# EAGLE design hygiea_v0.0 (EAGLE 8.6.0)

## Sheet 1 of 5: Description: Esquemático principal.
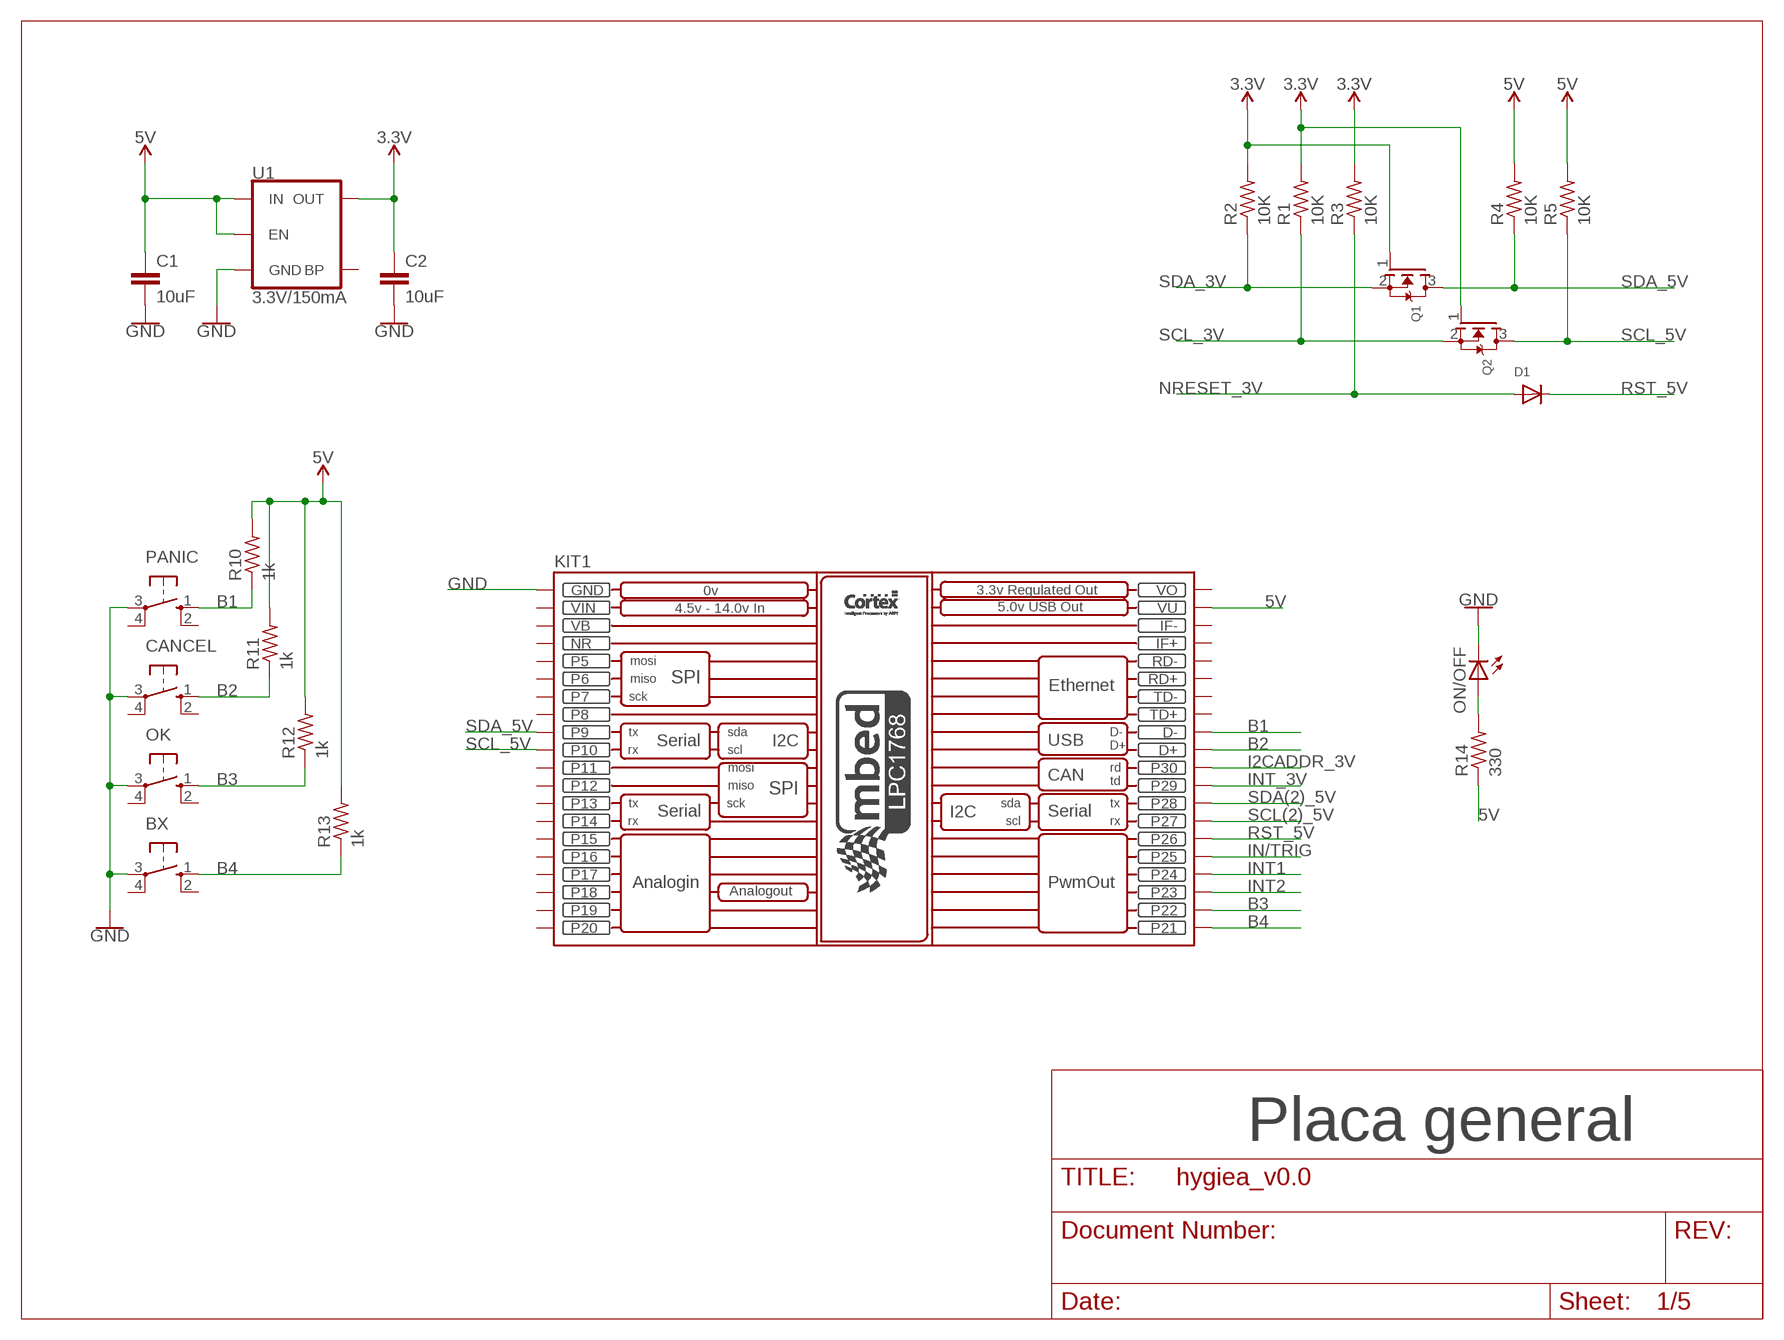
[diagram p0: schematic, sheet 1]

### Parts
BX  10-XX  [B3F-10XX]
C1  10uF  C-EUC0805  [C0805]
C2  10uF  C-EUC0805  [C0805]
CANCEL  10-XX  [B3F-10XX]
D1  DIODESOD-323F  [SOD-323F]
KIT1  MBED_NXP_LPC1768  [MBED-KIT]
OK  10-XX  [B3F-10XX]
ON/OFF  LEDCHIP-LED0805  [CHIP-LED0805]
PANIC  10-XX  [B3F-10XX]
Q1  MOSFET-NWAVE  [SOT23-W]
Q2  MOSFET-NWAVE  [SOT23-W]
R1  10K  R-US_R0805  [R0805]
R2  10K  R-US_R0805  [R0805]
R3  10K  R-US_R0805  [R0805]
R4  10K  R-US_R0805  [R0805]
R5  10K  R-US_R0805  [R0805]
R10  1k  R-US_R0805  [R0805]
R11  1k  R-US_R0805  [R0805]
R12  1k  R-US_R0805  [R0805]
R13  1k  R-US_R0805  [R0805]
R14  330  R-US_R0805  [R0805]
U1  3.3V/150mA  V_REG_MIC52053.3V  [SOT23-5]

### Nets
3.3V: C2.1 Q1.1(G) Q2.1(G) R1.2 R2.2 R3.2 U1.5(OUT) ; also sheet 2,5
5V: C1.1 KIT1.VU R4.2 R5.2 R10.2 R11.2 R12.2 R13.2 R14.1 U1.1(IN) U1.3(EN) ; also sheet 3,4
B1: KIT1.D- PANIC.1(S) R10.1
B2: CANCEL.1(S) KIT1.D+ R11.1
B3: KIT1.P$22(P22) OK.1(S) R12.1
B4: BX.1(S) KIT1.P$21(P21) R13.1
GND: BX.3(P) C1.2 C2.2 CANCEL.3(P) KIT1.GND OK.3(P) ON/OFF.C PANIC.3(P) U1.2(GND) ; also sheet 2,3,4,5
I2CADDR_3V: KIT1.P$30(P30) ; also sheet 2
IN/TRIG: KIT1.P$25(P25) ; also sheet 3
INT1: KIT1.P$24(P24) ; also sheet 5
INT2: KIT1.P$23(P23) ; also sheet 5
INT_3V: KIT1.P$29(P29) ; also sheet 2
N$1: ON/OFF.A R14.2
NRESET_3V: D1.A R3.1 ; also sheet 2
RST_5V: D1.C KIT1.P$26(P26)
SCL(2)_5V: KIT1.P$27(P27) ; also sheet 4
SCL_3V: Q2.2(S) R1.1 ; also sheet 2,5
SCL_5V: KIT1.P$10(P10) Q2.3(D) R5.1 ; also sheet 3
SDA(2)_5V: KIT1.P$28(P28) ; also sheet 4
SDA_3V: Q1.2(S) R2.1 ; also sheet 2,5
SDA_5V: KIT1.P$9(P9) Q1.3(D) R4.1 ; also sheet 3
Unconnected: BX.2(S1) BX.4(P1) CANCEL.2(S1) CANCEL.4(P1) KIT1.IF+ KIT1.IF- KIT1.P$5(P5) KIT1.P$6(P6) KIT1.P$7(P7) KIT1.P$8(P8) KIT1.P$11(P11) KIT1.P$12(P12) KIT1.P$13(P13) KIT1.P$14(P14) KIT1.P$15(P15) KIT1.P$16(P16) KIT1.P$17(P17) KIT1.P$18(P18) KIT1.P$19(P19) KIT1.P$20(P20) KIT1.RD+ KIT1.RD- KIT1.TD+ KIT1.TD- OK.2(S1) OK.4(P1) PANIC.2(S1) PANIC.4(P1) U1.4(BP)

### Notes on the sheet
- Placa general

## Sheet 2 of 5: BNO055
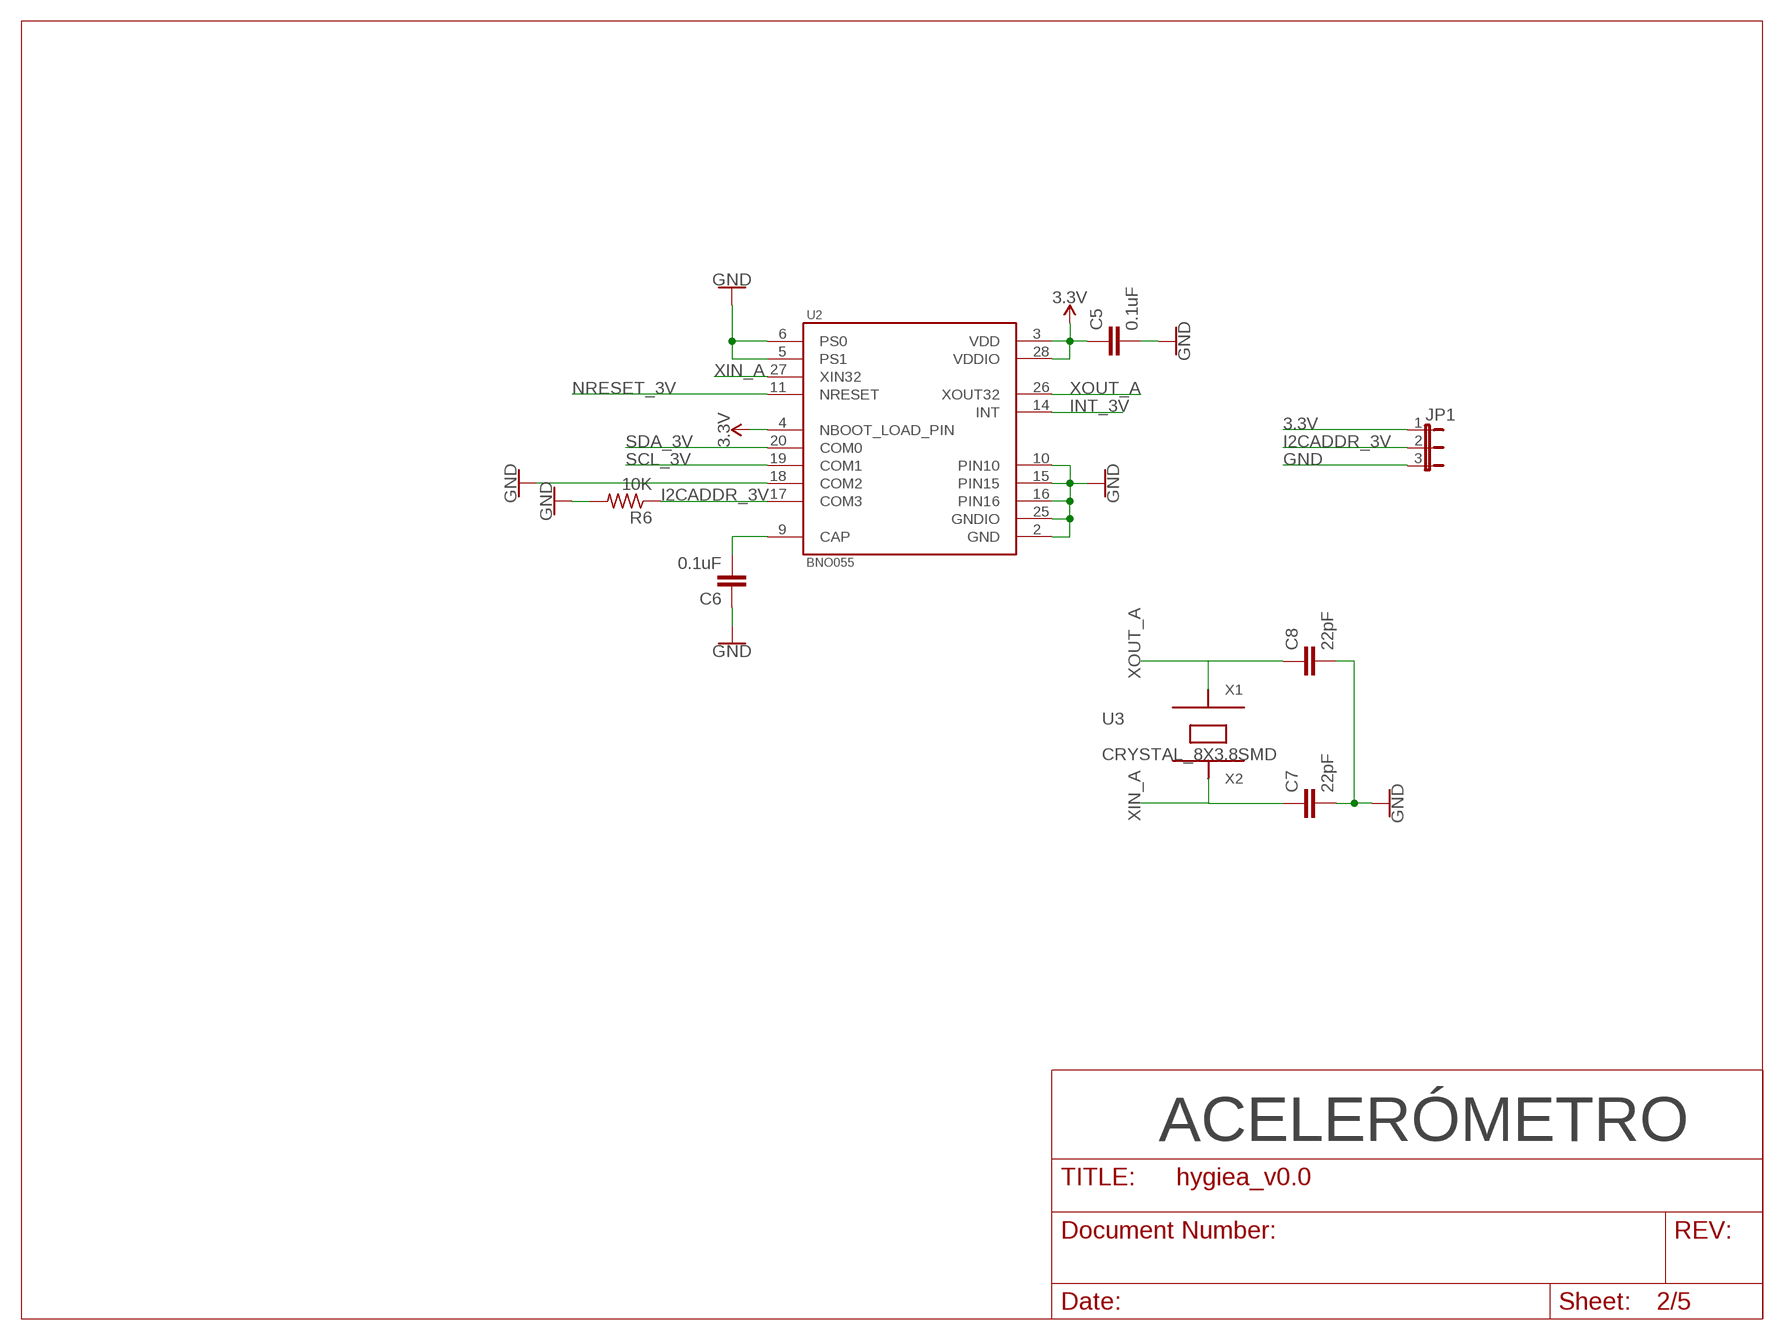
[diagram p1: schematic, sheet 2]

### Parts
C5  0.1uF  C-EUC0805  [C0805]
C6  0.1uF  C-EUC0805  [C0805]
C7  22pF  C-EUC0805  [C0805]
C8  22pF  C-EUC0805  [C0805]
JP1  JP2E  [JP2]
R6  10K  R-US_R0805  [R0805]
U2  BNO055  [LGA28R50P4X10_380X520X100]
U3  CRYSTAL_8X3.8SMD  [PM8.0X3.8MM]

### Nets
3.3V: C5.1 JP1.1 U2.3(VDD) U2.4(NBOOT_LOAD_PIN) U2.28(VDDIO) ; also sheet 1,5
GND: C5.2 C6.1 C7.2 C8.2 JP1.3 R6.2 U2.2(GND) U2.5(PS1) U2.6(PS0) U2.10(PIN10) U2.15(PIN15) U2.16(PIN16) U2.18(COM2) U2.25(GNDIO) ; also sheet 1,3,4,5
I2CADDR_3V: JP1.2 R6.1 U2.17(COM3) ; also sheet 1
INT_3V: U2.14(INT) ; also sheet 1
N$3: C6.2 U2.9(CAP)
NRESET_3V: U2.11(NRESET) ; also sheet 1
SCL_3V: U2.19(COM1) ; also sheet 1,5
SDA_3V: U2.20(COM0) ; also sheet 1,5
XIN_A: C7.1 U2.27(XIN32) U3.4(X2)
XOUT_A: C8.1 U2.26(XOUT32) U3.1(X1)

### Notes on the sheet
- ACELERÓMETRO

## Sheet 3 of 5: DRV2605L
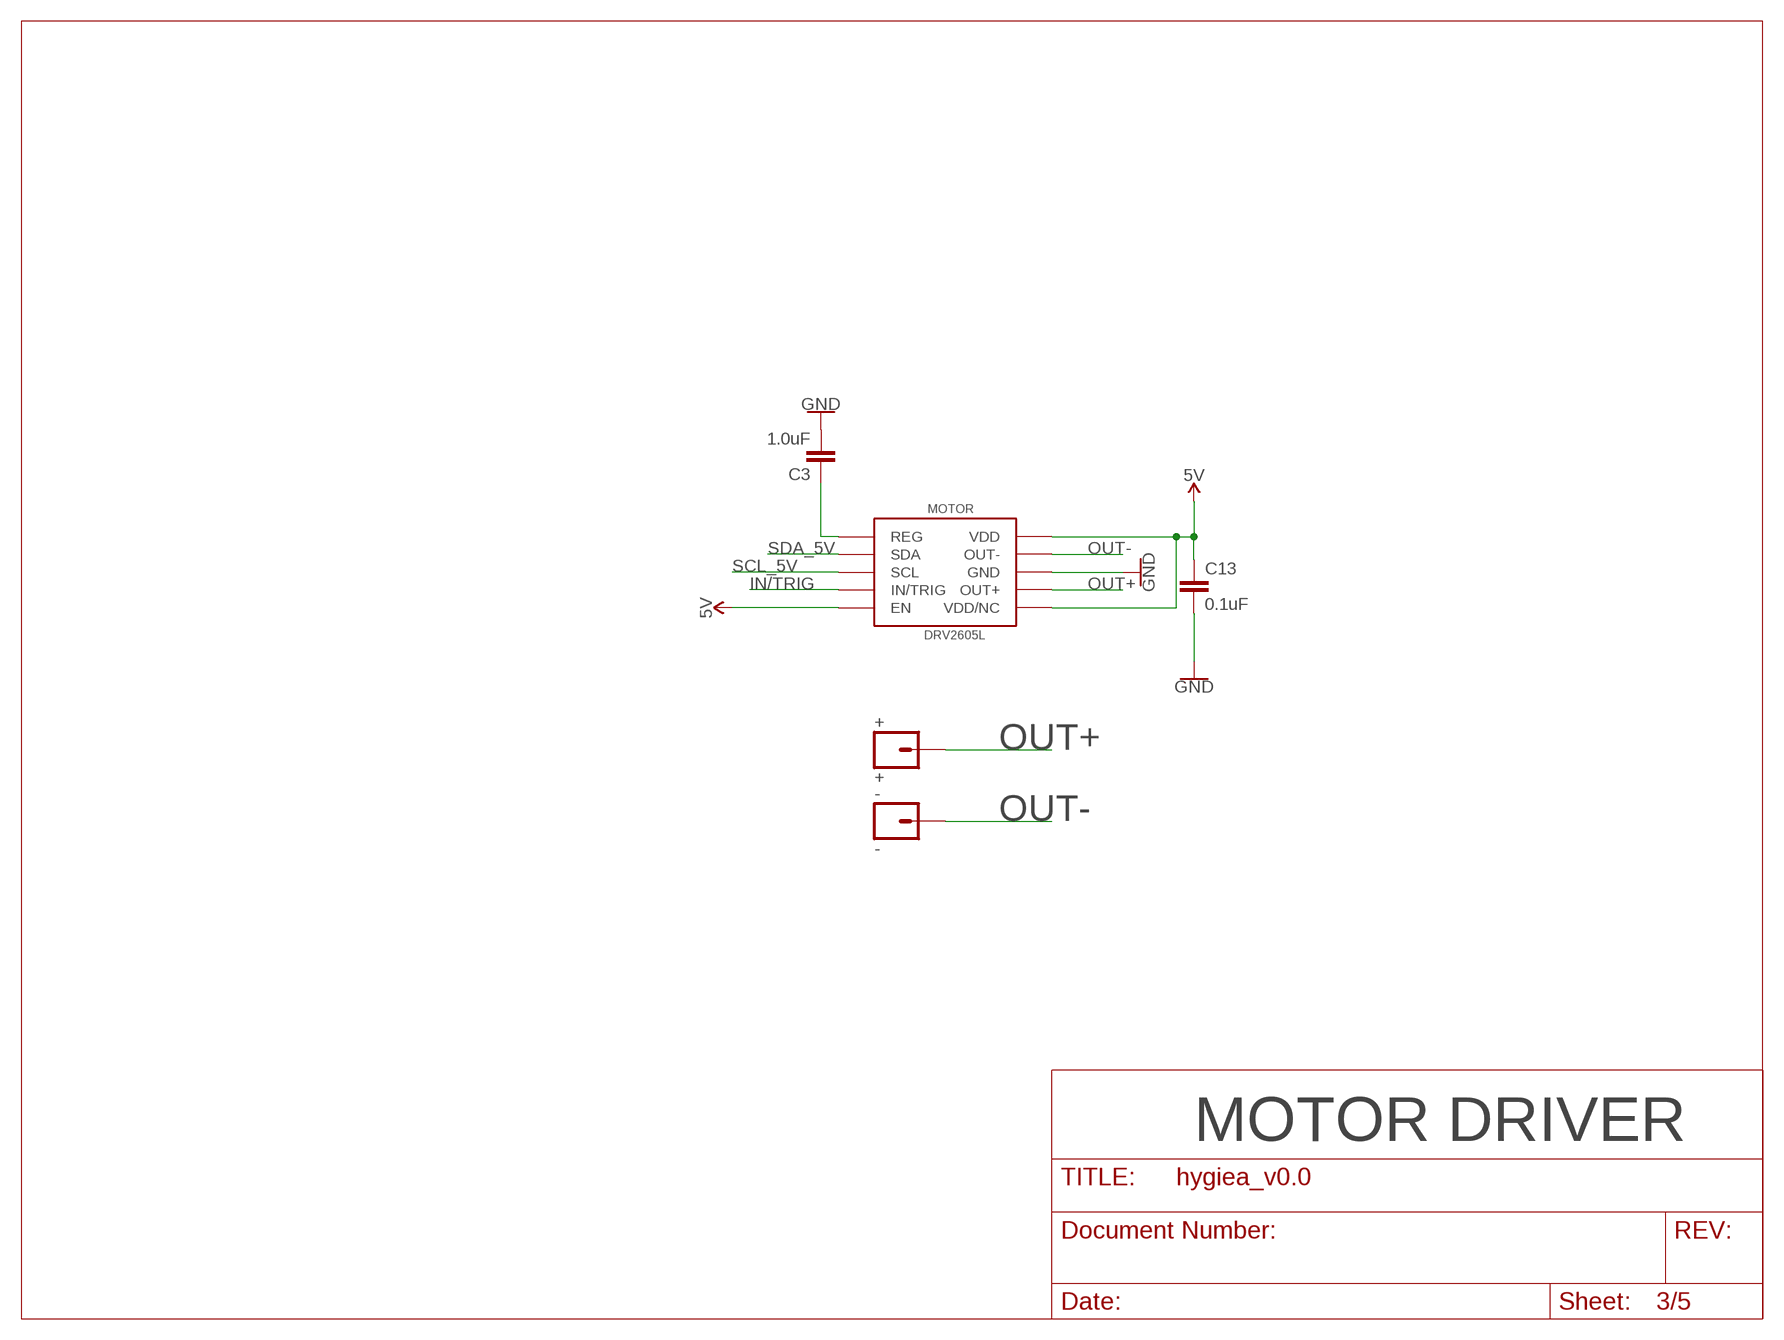
[diagram p2: schematic, sheet 3]

### Parts
+  +  CONN_01OFFSET  [1X01_OFFSET]
-  -  CONN_01OFFSET  [1X01_OFFSET]
C3  1.0uF  C-EUC0805  [C0805]
C13  0.1uF  C-EUC0805  [C0805]
MOTOR  DRV2605L  [VSSOP-10]

### Nets
5V: C13.1 MOTOR.P$5(EN) MOTOR.P$6(VDD/NC) MOTOR.P$10(VDD) ; also sheet 1,4
GND: C3.2 C13.2 MOTOR.P$8(GND) ; also sheet 1,2,4,5
IN/TRIG: MOTOR.P$4(IN/TRIG) ; also sheet 1
N$6: C3.1 MOTOR.P$1(REG)
OUT+: +.1 MOTOR.P$7(OUT+)
OUT-: -.1 MOTOR.P$9(OUT-)
SCL_5V: MOTOR.P$2(SCL) ; also sheet 1
SDA_5V: MOTOR.P$3(SDA) ; also sheet 1

### Notes on the sheet
- MOTOR DRIVER

## Sheet 4 of 5: BLE module
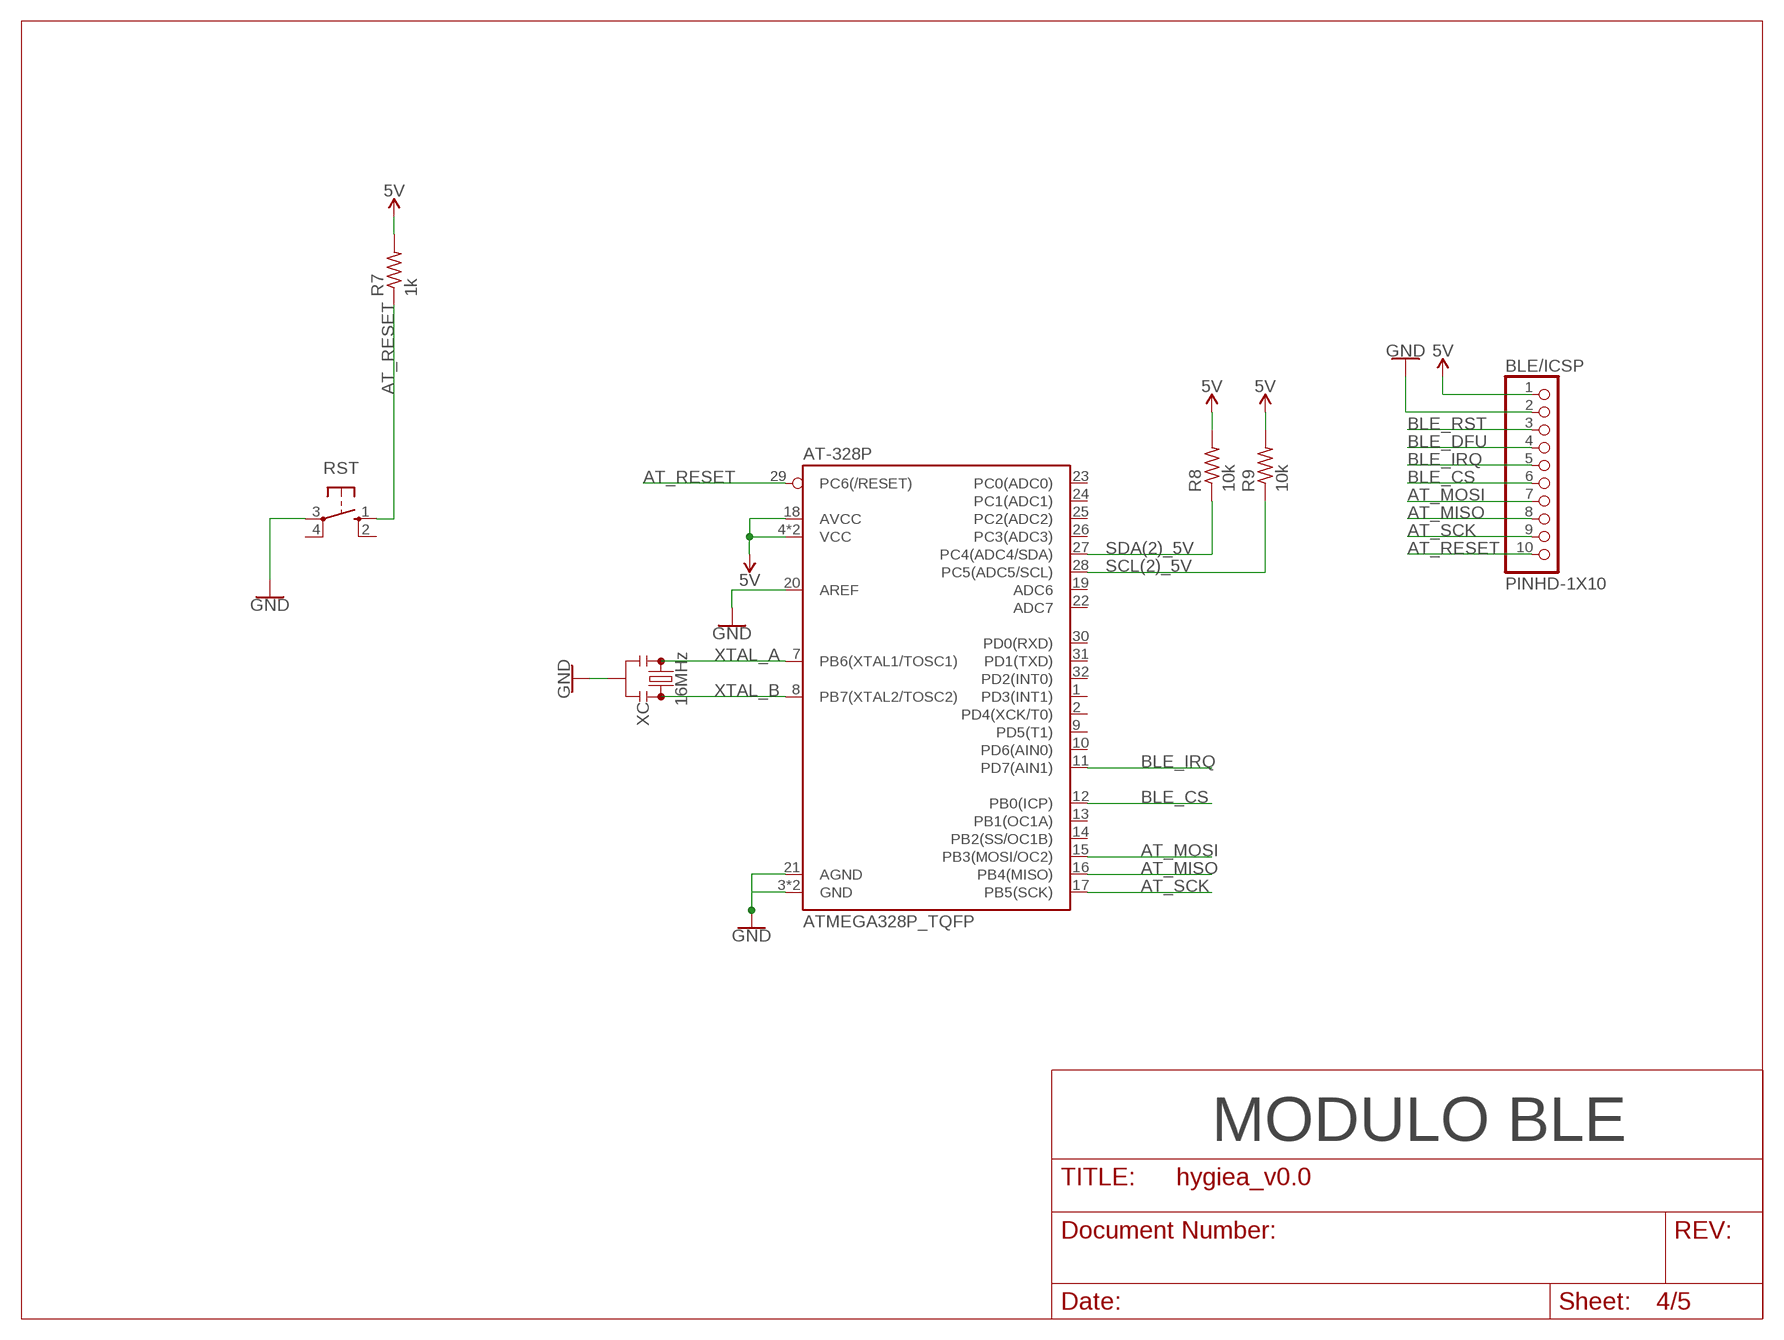
[diagram p3: schematic, sheet 4]

### Parts
AT-328P  ATMEGA328P_TQFP  [TQFP32-08]
BLE/ICSP  PINHD-1X10  [1X10-BIG]
R7  1k  R-US_R0805  [R0805]
R8  10k  R-US_R0805  [R0805]
R9  10k  R-US_R0805  [R0805]
RST  10-XX  [B3F-10XX]
XC  16MHz  RESONATOR-16MHZSMD_3.2X1.3  [RESONATOR-SMD-3.2X1.3]

### Nets
5V: AT-328P.4(VCC) AT-328P.6(VCC) AT-328P.18(AVCC) BLE/ICSP.1 R7.2 R8.2 R9.2 ; also sheet 1,3
AT_MISO: AT-328P.16(PB4(MISO)) BLE/ICSP.8
AT_MOSI: AT-328P.15(PB3(MOSI/OC2)) BLE/ICSP.7
AT_RESET: AT-328P.29(PC6(/RESET)) BLE/ICSP.10 R7.1 RST.1(S)
AT_SCK: AT-328P.17(PB5(SCK)) BLE/ICSP.9
BLE_CS: AT-328P.12(PB0(ICP)) BLE/ICSP.6
BLE_DFU: BLE/ICSP.4
BLE_IRQ: AT-328P.11(PD7(AIN1)) BLE/ICSP.5
BLE_RST: BLE/ICSP.3
GND: AT-328P.3(GND) AT-328P.5(GND) AT-328P.20(AREF) AT-328P.21(AGND) BLE/ICSP.2 RST.3(P) XC.2 ; also sheet 1,2,3,5
SCL(2)_5V: AT-328P.28(PC5(ADC5/SCL)) R9.1 ; also sheet 1
SDA(2)_5V: AT-328P.27(PC4(ADC4/SDA)) R8.1 ; also sheet 1
XTAL_A: AT-328P.7(PB6(XTAL1/TOSC1)) XC.3
XTAL_B: AT-328P.8(PB7(XTAL2/TOSC2)) XC.1
Unconnected: AT-328P.1(PD3(INT1)) AT-328P.2(PD4(XCK/T0)) AT-328P.9(PD5(T1)) AT-328P.10(PD6(AIN0)) AT-328P.13(PB1(OC1A)) AT-328P.14(PB2(SS/OC1B)) AT-328P.19(ADC6) AT-328P.22(ADC7) AT-328P.23(PC0(ADC0)) AT-328P.24(PC1(ADC1)) AT-328P.25(PC2(ADC2)) AT-328P.26(PC3(ADC3)) AT-328P.30(PD0(RXD)) AT-328P.31(PD1(TXD)) AT-328P.32(PD2(INT0)) RST.2(S1) RST.4(P1)

### Notes on the sheet
- MODULO BLE

## Sheet 5 of 5: MPL3115A2
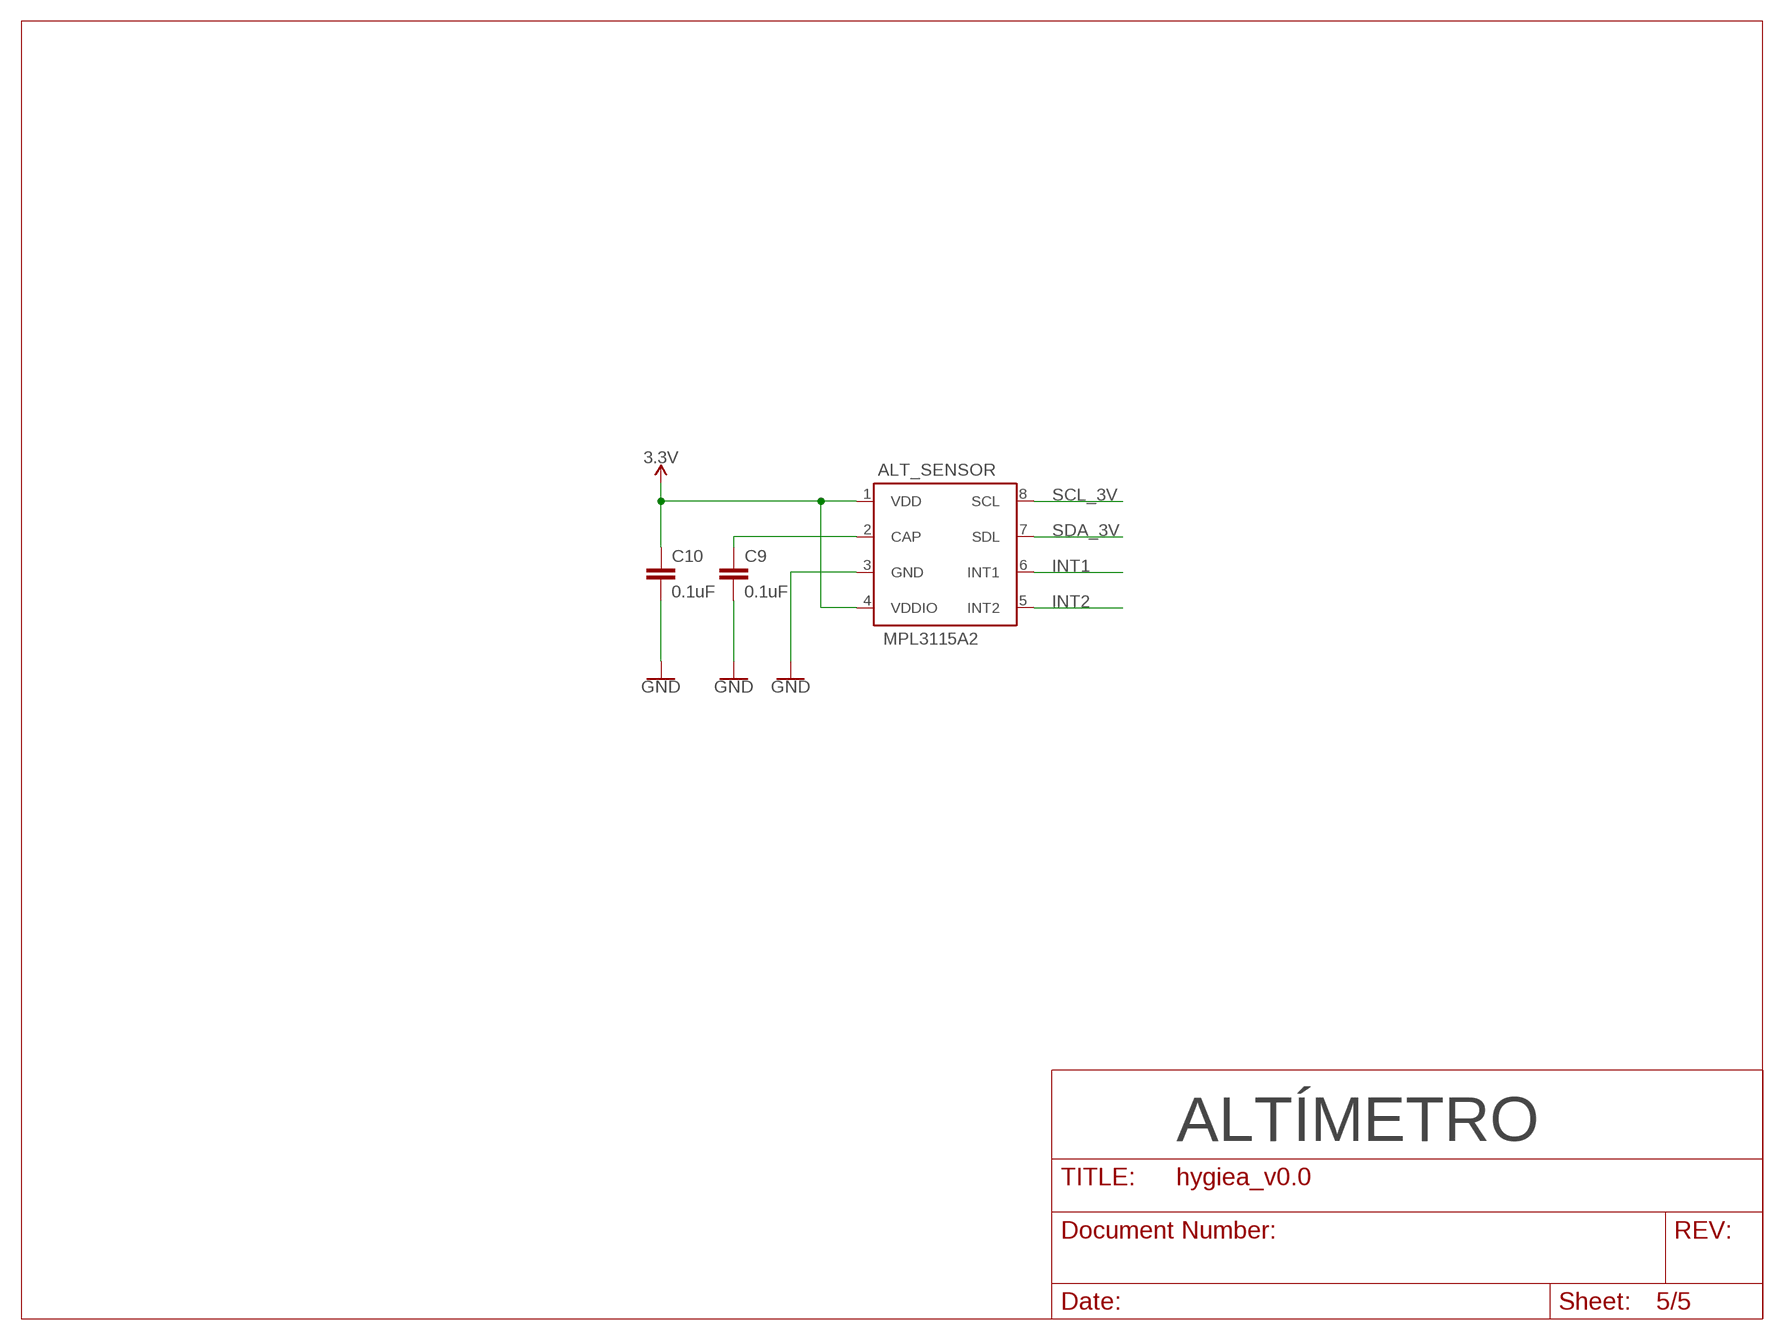
[diagram p4: schematic, sheet 5]

### Parts
ALT_SENSOR  MPL3115A2  [LGA8]
C9  0.1uF  C-EUC0805  [C0805]
C10  0.1uF  C-EUC0805  [C0805]

### Nets
3.3V: ALT_SENSOR.1(VDD) ALT_SENSOR.4(VDDIO) C10.1 ; also sheet 1,2
GND: ALT_SENSOR.3(GND) C9.2 C10.2 ; also sheet 1,2,3,4
INT1: ALT_SENSOR.6(INT1) ; also sheet 1
INT2: ALT_SENSOR.5(INT2) ; also sheet 1
N$2: ALT_SENSOR.2(CAP) C9.1
SCL_3V: ALT_SENSOR.8(SCL) ; also sheet 1,2
SDA_3V: ALT_SENSOR.7(SDL) ; also sheet 1,2

### Notes on the sheet
- ALTÍMETRO

## Power pins joined to a net without a drawn wire
NR: KIT1.NR
VB: KIT1.VB
VIN: KIT1.VIN
VO: KIT1.VOUT(VO)

## Library data of the parts
+ - = SparkFun-Connectors:CONN_01: Single connection point. Often used as Generic Header-pin footprint for 0.1 inch spaced/style header connections On any of the 0.1 inch spaced packages, you can populate with these: Break Away Headers - Straight <https://www.sparkfun.com/products/116> (PRT-00116) Break Away Male Headers - Right Angle <https://www.sparkfun.com/products/553> (PRT-00553) Female Headers <https://www.sparkfun.com/products/115> (PRT-00115) Break Away Headers - Machine Pin <https://www.sparkfun.com/products/117> (PRT-00117) Break Away Female Headers - Swiss Machine Pin <https://www.sparkfun.com/products/743> (PRT-00743) This device is also useful as a general connection point to wire up your design to another part of your project. Our various solder wires solder well into these plated through hole pads. Hook-Up Wire - Assortment (Stranded, 22 AWG) <https://www.sparkfun.com/products/11375> (PRT-11375) Hook-Up Wire - Assortment (Solid Core, 22 AWG) <https://www.sparkfun.com/products/11367> (PRT-11367) View the entire wire category on our website here <https://www.sparkfun.com/categories/141> Special notes: SMTSO-256-ET is a "flush mount" nut for a 4-40 screw. We mostly use this on specialty testbeds; it is a nice way to connect hardware to your PCB at an adjustable hieght. Also note, the SNAP packages are for using a snappable style connector. We sell a baggie of snaps and they are also used on two LilyPad designs: Snap Assortment - 30 pack (male and female) <https://www.sparkfun.com/products/11347> (DEV-11347) LilyPad Arduino SimpleSnap <https://www.sparkfun.com/products/10941> (DEV-10941) LilyPad SimpleSnap Protoboard <https://www.sparkfun.com/products/10940> (DEV-10940)
ALT_SENSOR = hygiea_parts:MPL3115A2
AT-328P = SparkFun-IC-Microcontroller:ATMEGA328P_TQFP: Popular 328P in QFP Storefront component: ATmega328 - TQFP <https://www.sparkfun.com/products/13448> (COM-13448) Datasheet <http://www.sparkfun.com/datasheets/Components/SMD/ATMega328.pdf> SparkFun Products SparkFun RedBoard - Programmed with Arduino <https://www.sparkfun.com/products/12757> (DEV-12757) Arduino Pro Mini 328 - 5V/16MHz <https://www.sparkfun.com/products/11113> (DEV-11113) Arduino Pro Mini 328 - 3.3V/8MHz <https://www.sparkfun.com/products/11114> (DEV-11114) SparkFun OpenLog <https://www.sparkfun.com/products/13712> (DEV-13712) SparkFun MicroView - OLED Arduino Module <https://www.sparkfun.com/products/12923> (DEV-12923) SparkFun Digital Sandbox <https://www.sparkfun.com/products/12651> (DEV-12651) SparkFun PicoBoard <https://www.sparkfun.com/products/11888> (WIG-11888) Arduino Fio <https://www.sparkfun.com/products/10116> (DEV-10116) LilyPad Arduino 328 Main Board <https://www.sparkfun.com/products/13342> (DEV-13342) SparkFun RedStick <https://www.sparkfun.com/products/13741> (DEV-13741) LilyPad MP3 <https://www.sparkfun.com/products/11013> (DEV-11013) LilyPad Arduino SimpleSnap <https://www.sparkfun.com/products/10941> (DEV-10941) SparkFun Stepoko <https://www.sparkfun.com/products/13899> (ROB-13899) SparkFun Geiger Counter <https://www.sparkfun.com/products/11345> (SEN-11345) SparkFun EL Sequencer <https://www.sparkfun.com/products/12781> (COM-12781) Arduino Pro 328 - 5V/16MHz <https://www.sparkfun.com/products/10915> (DEV-10915) CryptoCape <https://www.sparkfun.com/products/12773> (DEV-12773) SparkFun IR Thermometer Evaluation Board - MLX90614 <https://www.sparkfun.com/products/10740> (SEN-10740) SparkFun RedBot Mainboard <https://www.sparkfun.com/products/12097> (ROB-12097) Arduino Pro 328 - 3.3V/8MHz <https://www.sparkfun.com/products/10914> (DEV-10914) SparkFun Block for Intel® Edison - Arduino <https://www.sparkfun.com/products/13036> (DEV-13036) SparkFun Simon Says - Surface Mount Soldering Kit <https://www.sparkfun.com/products/10935> (KIT-10935) SparkFun 7-Segment Serial Display - Red <https://www.sparkfun.com/products/11441> (COM-11441) SparkFun 7-Segment Serial Display - White <https://www.sparkfun.com/products/11629> (COM-11629) SparkFun 7-Segment Serial Display - Yellow <https://www.sparkfun.com/products/11443> (COM-11443) SparkFun 7-Segment Serial Display - Kelly Green <https://www.sparkfun.com/products/11440> (COM-11440) SparkFun 7-Segment Serial Display - Blue <https://www.sparkfun.com/products/11442> (COM-11442) SparkFun OpenSegment Serial Display - 20mm (Blue) <https://www.sparkfun.com/products/11647> (COM-11647) SparkFun OpenSegment Serial Display - 20mm (Green) <https://www.sparkfun.com/products/11646> (COM-11646) SparkFun OpenSegment Serial Display - 20mm (White) <https://www.sparkfun.com/products/11648> (COM-11648) SparkFun OpenSegment Serial Display - 20mm (Red) <https://www.sparkfun.com/products/11644> (COM-11644) SparkFun OpenSegment Serial Display - 20mm (Yellow) <https://www.sparkfun.com/products/11645> (COM-11645) SparkFun OpenSegment Shield <https://www.sparkfun.com/products/13190> (DEV-13190); PROD_ID: IC-09069
BLE/ICSP = adafruit:PINHD-1X10: Pin header 1x10 0.1" spacing With round pins
BX CANCEL OK PANIC RST = switch-omron:10-XX: OMRON SWITCH; MPN: B3F-1000; OC_FARNELL: 176432; OC_NEWARK: 36M3542
C1-C3 C5-C10 C13 = rcl:C-EU: CAPACITOR, European symbol; SPICEPREFIX: C
D1 = adafruit:DIODE: Diode SMADIODE - SMA Surface Mount Package 20V 1A Schottky Diode Digikey: 641-1014-6-ND DO-1N4148 - Through Hole Small Current Diode SOD-123 20V 1 A (.5mV Vf) Schottky Diode - Digikey: MBRX120TPMSCT-ND SOD-323 10V 570mA (.38mV Vf, 3ns) Schottky Diode - Digikey: ZLLS410CT-ND SOD-523 30V 30mA Schottky Diode (RB751S-40TE61) - Digikey: RB751S-40TE61CT-ND SOT23-R/W - SOT23 Package (R = Solder Paste/Reflow Ovens, W = Hand-Soldering) BAT54Film 40V 300mA - Digikey: 497-7162-1-ND
JP1 = jumper:JP2E: JUMPER
KIT1 = MBED_v2.1:MBED_NXP_LPC1768: Mbed LPC1768 - ARM CORTEX v2.1 * Schematic symbol is now placed in eagles's default raster. *The pads diameter are suitable for routing between mbed pins * mbed pads are 0.8 mm drill diameter. --------------------------------------------- Created by: Mohamed Yousry *Alexandria, Egypt *Email: mohamed.yousry@ieeegoldegypt.org
MOTOR = SparkFun-IC-Special-Function:DRV2605L; PROD_ID: IC-13504
ON/OFF = adafruit:LED: LED OSRAM: - CHIPLED LG R971, LG N971, LY N971, LG Q971, LY Q971, LO R971, LY R971 LH N974, LH R974 LS Q976, LO Q976, LY Q976 LO Q996 - Hyper CHIPLED LW Q18S LB Q993, LB Q99A, LB R99A - SideLED LS A670, LO A670, LY A670, LG A670, LP A670 LB A673, LV A673, LT A673, LW A673 LH A674 LY A675 LS A676, LA A676, LO A676, LY A676, LW A676 LS A679, LY A679, LG A679 - Hyper Micro SIDELED® LS Y876, LA Y876, LO Y876, LY Y876 LT Y87S - SmartLED LW L88C, LW L88S LB L89C, LB L89S, LG L890 LS L89K, LO L89K, LY L89K LS L896, LA L896, LO L896, LY L896 - TOPLED LS T670, LO T670, LY T670, LG T670, LP T670 LSG T670, LSP T670, LSY T670, LOP T670, LYG T670 LG T671, LOG T671, LSG T671 LB T673, LV T673, LT T673, LW T673 LH T674 LS T676, LA T676, LO T676, LY T676, LB T676, LH T676, LSB T676, LW T676 LB T67C, LV T67C, LT T67C, LS T67K, LO T67K, LY T67K, LW E67C LS E67B, LA E67B, LO E67B, LY E67B, LB E67C, LV E67C, LT E67C LW T67C LS T679, LY T679, LG T679 LS T770, LO T770, LY T770, LG T770, LP T770 LB T773, LV T773, LT T773, LW T773 LH T774 LS E675, LA E675, LY E675, LS T675 LS T776, LA T776, LO T776, LY T776, LB T776 LHGB T686 LT T68C, LB T68C - Hyper Mini TOPLED® LB M676 - Mini TOPLED Santana® LG M470 LS M47K, LO M47K, LY M47K Source: http://www.osram.convergy.de/
Q1 Q2 = adafruit:MOSFET-N: N-Channel Mosfet 2N7002E - 60V 260mA SOT23 [Digikey: 2N7002ET1GOSTR-ND] - REEL BSH103 - 30V 850mA SOT23 [Digikey: 568-5013-1-ND]
R1-R14 = adafruit:R-US_: RESISTOR, American symbol
U1 = SparkFun-IC-Power:V_REG_MIC5205: V_REG MIC5205 Standard 3.3V, 5V, and Adjustable 150mA LDO voltage regulator in SOT-23 layout. Micrel part MIC5205. BP (by-pass) pin is used to lower output noise with 470pF cap, may be left open. On the adjustable version BP is used to set output.; PROD_ID: VREG-00822
U2 = BNO055:BNO055: BNO055 9-axis Absolute Orientation Sensor ( SiP ) w/Sensors and Sensor Fusion; DESCRIPTION: IMU ACCEL/GYRO/MAG I2C 28LGA; DIGI-KEY_PART_NUMBER: 828-1058-1-ND; DIGI-KEY_PURCHASE_URL: https://www.digikey.com.mx/product-detail/en/bosch-sensortec/BNO055/828-1058-1-ND/6136309?WT.z_cid=ref_snapeda&utm_source=snapeda&utm_medium=aggregator&utm_campaign=buynow; MF: Bosch; MP: BNO055; PACKAGE: LGA-28 Bosch
U3 = hygiea_parts:CRYSTAL_8X3.8: Description: Cristal oscilador necesario para el sensor BNO055 de Bosch.
XC = SparkFun-Clocks:RESONATOR-16MHZ: 16MHz Resonator Digikey Example <http://www.digikey.com/product-detail/en/murata-electronics-north-america/CSTCE16M0V53-R0/490-1198-1-ND/584635> Frequency: 16MHz Frequency Stability: ±0.3% Frequency Tolerance: ±0.5% Capacitance: 15pF SparkFun Products SparkFun OpenLog <https://www.sparkfun.com/products/13712> SparkFun MicroView - OLED Arduino Module <https://www.sparkfun.com/products/12923>; PROD_ID: XTAL-08900

## Board
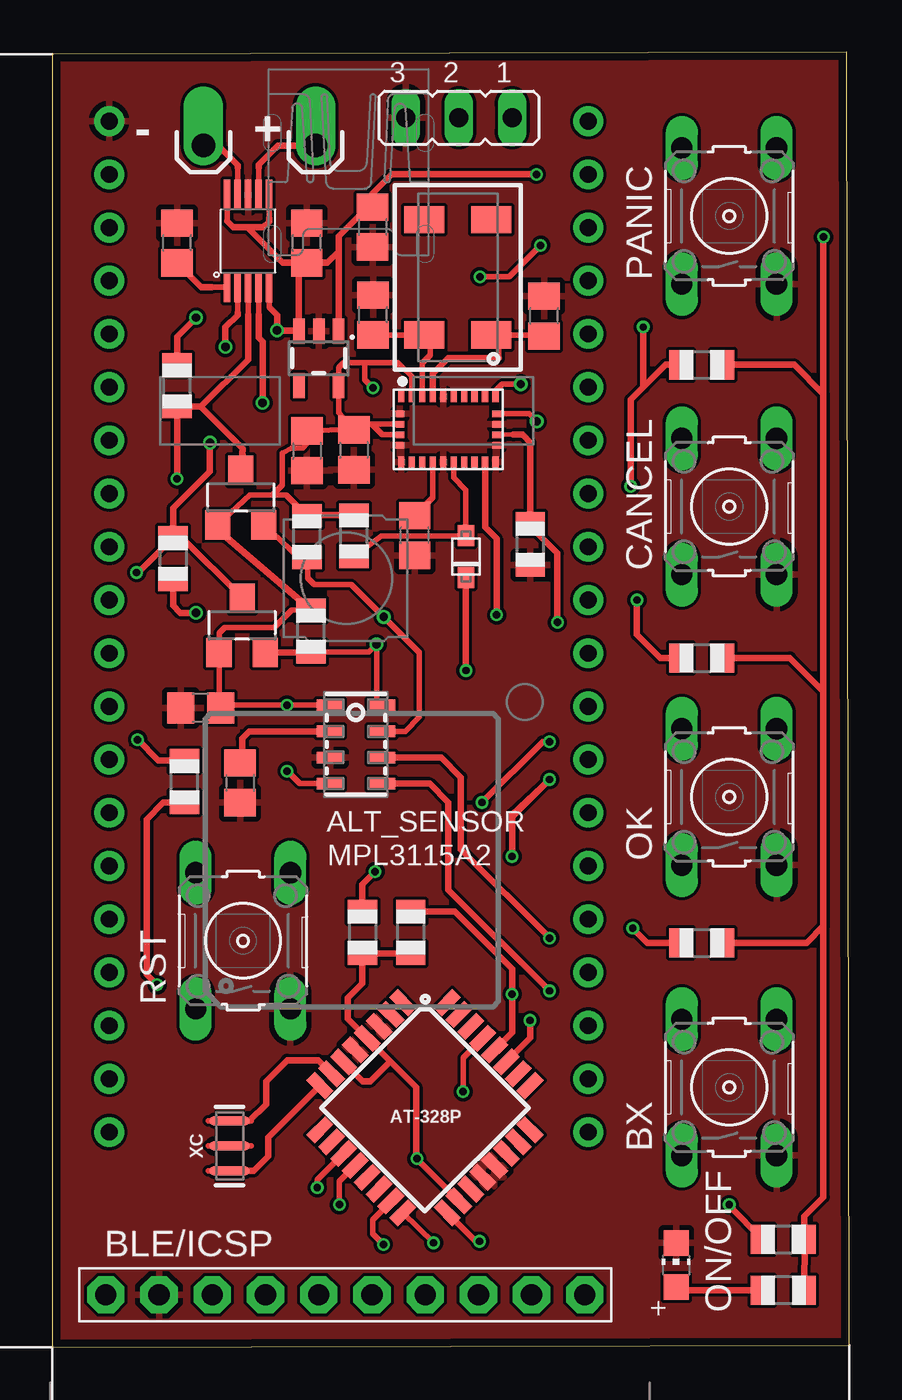
[diagram p5: board, top side]
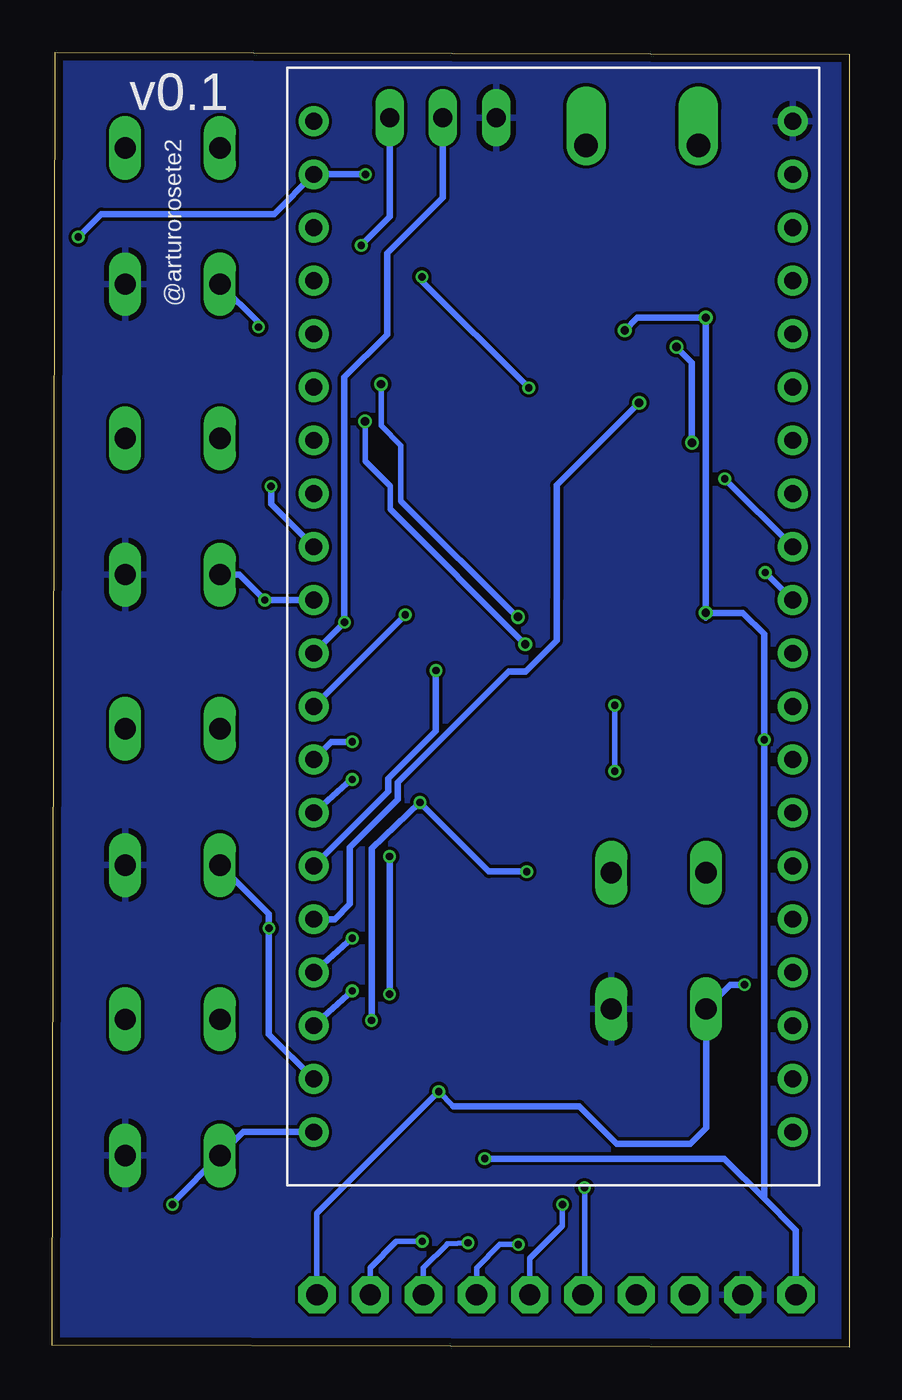
[diagram p6: board, bottom side, seen from below]

Size 38.04 x 61.81 mm. Coordinates in mm from the lower left corner, seen from the top.
Outline: 0,0 38.04,0.1 37.91,61.81 0,61.71 0,0
Copper layers (1*16): Top 0.035559375mm / dielectric 1.6mm / Bottom 0.035559375mm
Design rules "oshpark-2layer": minimum track width 6mil, minimum drill 10mil, track to track 6mil, track to pad 6mil, pad to pad 6mil, via to via 6mil, smd to smd 6mil, copper to edge 15mil, drill to drill 6mil, minimum pad ring 5mil, minimum via ring 5mil, stop-mask expansion 2.5mil, vias tented up to drill 0mil, thermal gap 10mil

### Footprints (pad centres in the part's own frame; a part is rotated, then mirrored left to right if it is on the bottom)
1X01_OFFSET = drill 1.118 pad 1.88 offset: 1 0,0
LGA8 = smd 1.291 x 0.55: 1 -1.227,1.875; 2 -1.227,0.625; 3 -1.227,-0.625; 4 -1.227,-1.875; 5 1.227,-1.875; 6 1.227,-0.625; 7 1.227,0.625; 8 1.227,1.875
TQFP32-08 = smd 1.27 x 0.559: 1 -4.293,2.8; 2 -4.293,2; 3 -4.293,1.2; 4 -4.293,0.4; 5 -4.293,-0.4; 6 -4.293,-1.2; 7 -4.293,-2; 8 -4.293,-2.8; 17 4.293,-2.8; 18 4.293,-2; 19 4.293,-1.2; 20 4.293,-0.4; 21 4.293,0.4; 22 4.293,1.2; 23 4.293,2; 24 4.293,2.8 | smd 0.559 x 1.27: 9 -2.8,-4.293; 10 -2,-4.293; 11 -1.2,-4.293; 12 -0.4,-4.293; 13 0.4,-4.293; 14 1.2,-4.293; 15 2,-4.293; 16 2.8,-4.293; 25 2.8,4.293; 26 2,4.293; 27 1.2,4.293; 28 0.4,4.293; 29 -0.4,4.293; 30 -1.2,4.293; 31 -2,4.293; 32 -2.8,4.293
1X10-BIG = drill 1.016 pad 1.778 octagon: 1 -11.43,0; 2 -8.89,0; 3 -6.35,0; 4 -3.81,0; 5 -1.27,0; 6 1.27,0; 7 3.81,0; 8 6.35,0; 9 8.89,0; 10 11.43,0
B3F-10XX = drill 1.016 long: 1 -3.251,2.261; 2 3.251,2.261; 3 -3.251,-2.261; 4 3.251,-2.261
C0805 = smd 1.3 x 1.5: 1 -0.95,0; 2 0.95,0
SOD-323F = smd 1 x 0.8: A -1,0; C 1,0
JP2 = drill 0.914 long: 1 -2.54,0; 2 0,0; 3 2.54,0
MBED-KIT = drill 0.8 pad 1.422: D+ 11.43,1.27; D- 11.43,3.81; GND -11.43,24.13; IF+ 11.43,16.51; IF- 11.43,19.05; NR -11.43,16.51; P$5 -11.43,13.97; P$6 -11.43,11.43; P$7 -11.43,8.89; P$8 -11.43,6.35; P$9 -11.43,3.81; P$10 -11.43,1.27; P$11 -11.43,-1.27; P$12 -11.43,-3.81; P$13 -11.43,-6.35; P$14 -11.43,-8.89; P$15 -11.43,-11.43; P$16 -11.43,-13.97; P$17 -11.43,-16.51; P$18 -11.43,-19.05; P$19 -11.43,-21.59; P$20 -11.43,-24.13; P$21 11.43,-24.13; P$22 11.43,-21.59; P$23 11.43,-19.05; P$24 11.43,-16.51; P$25 11.43,-13.97; P$26 11.43,-11.43; P$27 11.43,-8.89; P$28 11.43,-6.35; P$29 11.43,-3.81; P$30 11.43,-1.27; RD+ 11.43,11.43; RD- 11.43,13.97; TD+ 11.43,6.35; TD- 11.43,8.89; VB -11.43,19.05; VIN -11.43,21.59; VOUT 11.43,24.13; VU 11.43,21.59
VSSOP-10 = smd 1.45 x 0.3: P$1 -1.905,1.06; P$2 -1.905,0.56; P$3 -1.905,0.06; P$4 -1.905,-0.44; P$5 -1.905,-0.94; P$6 2.495,-0.94; P$7 2.495,-0.44; P$8 2.495,0.06; P$9 2.495,0.56; P$10 2.495,1.06
CHIP-LED0805 = smd 1.2 x 1.2: A 0,-1.05; C 0,1.05
SOT23-W = smd 1.2 x 1.4: 1 -1.1,-1.3; 2 1.1,-1.3; 3 0,1.3
R0805 = smd 1.1 x 1.4: 1 -1,0; 2 1,0
SOT23-5 = smd 0.55 x 1.2: 1 -0.95,-1.3; 2 0,-1.3; 3 0.95,-1.3; 4 0.95,1.3; 5 -0.95,1.3
LGA28R50P4X10_380X520X100 = smd 0.3 x 0.525: 1 -2.25,1.562; 6 -2.25,-1.562; 7 -1.75,-1.562; 8 -1.25,-1.562; 9 -0.75,-1.562; 10 -0.25,-1.562; 11 0.25,-1.562; 12 0.75,-1.562; 13 1.25,-1.562; 14 1.75,-1.562; 15 2.25,-1.562; 20 2.25,1.562; 21 1.75,1.562; 22 1.25,1.562; 23 0.75,1.562; 24 0.25,1.562; 25 -0.25,1.562; 26 -0.75,1.562; 27 -1.25,1.562; 28 -1.75,1.562 | smd 0.425 x 0.3: 2 -2.312,0.75; 3 -2.312,0.25; 4 -2.312,-0.25; 5 -2.312,-0.75; 16 2.312,-0.75; 17 2.312,-0.25; 18 2.312,0.25; 19 2.312,0.75
PM8.0X3.8MM = smd 1.3 x 1.9: 1 -2.75,-1.6; 2 2.75,-1.6; 3 2.75,1.6; 4 -2.75,1.6
RESONATOR-SMD-3.2X1.3 = smd 0.45 x 1.905: 1 -1.2,0; 2 0,0; 3 1.2,0

### Placement (x,y rotation side)
+  12.56,57.37 0 top
-  7.21,57.37 0 top
ALT_SENSOR  14.48,28.77 0 top
AT-328P  17.78,11.43 315 top
BLE/ICSP  13.98,2.5 0 top
BX  32.3,12.4 90 top
C1  15.29,53.48 270 top
C2  12.14,42.8 270 top
C3  5.95,52.71 90 top
C5  14.39,42.84 270 top
C6  17.3,38.75 90 top
C7  15.3,49.27 90 top
C8  23.47,49.22 90 top
C9  8.96,26.94 270 top
C10  7.08,30.51 180 top
C13  12.14,52.71 90 top
CANCEL  32.3,40.13 90 top
D1  19.74,37.74 270 top
JP1  19.4,58.7 180 top
KIT1  14.14,34.4 0 top
MOTOR  9.4,52.51 90 top
OK  32.3,26.27 90 top
ON/OFF  29.77,3.92 0 top
PANIC  32.3,54 90 top
Q1  8.99,40.56 0 top
Q2  9.05,34.46 0 top
R1  12.35,34.18 90 top
R2  12.14,38.7 90 top
R3  14.39,38.73 90 top
R4  5.95,45.9 90 top
R5  5.76,37.65 270 top
R6  22.8,38.33 270 top
R7  6.3,27 90 top
R8  14.8,19.8 270 top
R9  17.1,19.8 270 top
R10  31,46.9 0 top
R11  31,32.9 0 top
R12  31,19.3 0 top
R13  34.89,5.15 0 top
R14  34.89,2.71 180 top
RST  9.1,19.4 90 top
U1  12.71,47.2 180 top
U2  18.9,43.81 0 top
U3  19.35,51.07 90 top
XC  8.46,9.61 90 top

### Tracks (layer width: path | path; a pad name or v marks a point on that pad's centre or on a via)
3.3V  (via drill 0.35)
  Top 0.254: C5.1 14.56,44.06 15.24,44.06 | U2.28 17.15,46.35 16.64,46.86 16.6,46.86 16.46,47 14.9,47 | C5.1 14.3,43.8 C2.1 12.14,43.13 11.94,42.93 11.43,42.93 10.98,42.67 10.98,41.16 10.5,40.68 | 15.24,44.06 15.74,43.56 U2.4 | 7.99,33.13 Q2.1 | 7.99,33.13 8.03,33.09 | Q1.1 9.41,40.68 10.5,40.68 | Q2.1 7.95,34.09 8.23,34.37 10.6,34.37 11.42,35.18 R1.2 | 7.99,32.92 7.99,33.13 | U2.3 15.24,44.06 | 14.9,47 13.9,47 13.66,46.76 U1.5 13.66,44.61 C5.1 | 14.9,47 14.9,46.2 v15.3,45.8 | v20.4,51.1 21.8,51.1 v23.3,52.6 | R2.2 11.16,40.68 10.5,40.68 | ALT_SENSOR.1 v11.2,30.65 8.16,30.65 C10.1 7.95,30.59 Q2.1 | ALT_SENSOR.4 11.8,26.9 v11.2,27.5
  Top 0.305: Q1.1 8,38.93 R1.2 | R3.2 12.19,39.73 R2.2
  Bottom 0.254: v15.3,45.8 20.4,50.9 v20.4,51.1 | v11.2,27.5 11.2,29.9 11.2,30.55 v11.2,30.64 v11.2,30.65
  Bottom 0.305: JP1.1 21.94,53.96 v23.3,52.6
5V  (via drill 0.35, 0.4, 0.4 pad 0.6)
  Top 0.254: 16.07,13.6 16.07,13.7 | v17.4,9 17.35,9 17.36,9.02 | 11.76,51.84 C13.1 | MOTOR.P$5 10.34,49.66 10.58,49.42 | MOTOR.P$6 10.34,53.9 | MOTOR.P$10 8.34,53.76
  Top 0.305: 8.34,53.76 8.64,53.47 9.3,53.47 | v23.1,55.99 16.19,55.99 15.29,55.09 C1.1 15.06,54.43 13.66,53.03 13.66,52.3 | AT-328P.6 14.81,12.7 15.18,12.7 16.07,13.6 | AT-328P.18 17.36,9.02 17.36,12.41 16.07,13.7 AT-328P.4 14.09,15.68 14.09,16.66 14.8,17.37 R8.2 R9.2 | v6.86,35.05 6.11,35.05 5.76,35.4 R5.2 | 10.34,53.9 10.34,53.74 10.07,53.47 9.3,53.47 | U1.1 13.66,52.3 | 11.76,51.84 U1.3 11.73,48.54 v10.72,48.54 10.72,49.28 10.58,49.42 | R4.2 5.95,48.24 v6.86,49.15 | 36.8,45.5 v36.8,53 | 36.8,45.5 36.8,31.3 | 36.8,31.3 36.8,20.1 | R14.1 35.9,5.13 R13.2 35.89,6.25 36.8,7.16 36.8,20.1 | R11.2 35.2,32.9 36.8,31.3 | R10.2 35.4,46.9 36.8,45.5 | R12.2 36,19.3 36.8,20.1 | R7.2 5.06,28 v4.06,29 | 9.3,53.47 11,51.76 C13.1 13.13,51.76 13.66,52.3
  Bottom 0.254: 6.86,45.43 6.86,44.45 | v6.86,35.05 6.86,34.8
  Bottom 0.305: 4.06,7.1 v4.06,29 4.06,34.04 5.08,35.05 v6.86,35.05 6.86,44.45 v6.86,49.15 10.11,49.15 v10.72,48.54 | BLE/ICSP.1 2.55,5.59 4.06,7.1 | 4.06,7.1 5.96,9 v17.4,9 | v23.1,55.99 KIT1.VU 27.46,54.1 35.7,54.1 v36.8,53
AT_MISO  (via drill 0.35)
  Top 0.254: v18.2,4.98 AT-328P.16
  Bottom 0.254: v18.2,4.98 19.2,4.93 19.2,4.92 20.33,3.79 BLE/ICSP.8
AT_MOSI  (via drill 0.35)
  Top 0.254: v15.8,4.9 15.28,5.42 15.28,6.07 16.16,6.95 AT-328P.15
  Bottom 0.254: v15.8,4.9 16.69,4.9 17.79,3.8 BLE/ICSP.7
AT_RESET  (via drill 0.35)
  Top 0.254: AT-328P.29 19.6,13.82 v19.6,12.2
  Top 0.305: R7.1 5.3,26 4.5,25.2 4.5,17.8 v5,17.3
  Bottom 0.254: BLE/ICSP.10 25.41,6.39 v19.6,12.2 18.9,11.5
  Bottom 0.305: 18.9,11.5 12.9,11.5 11.1,9.7 7.6,9.7 6.84,10.46 RST.1 5.69,17.3 v5,17.3
AT_SCK  (via drill 0.35)
  Top 0.254: v20.39,5.06 20.19,5.06 AT-328P.17
  Bottom 0.254: v20.39,5.06 21.61,5.06 21.62,5.04 22.87,3.79 BLE/ICSP.9
B1  (via drill 0.35)
  Top 0.305: v28.2,48.7 28.2,45.83 | v27.6,41.1 27.6,45.23 28.2,45.83 | R10.1 29.27,46.9 28.2,45.83
  Bottom 0.305: KIT1.D- 27.6,40.24 v27.6,41.1 | PANIC.1 28.2,48.91 v28.2,48.7
B2  (via drill 0.35)
  Top 0.305: R11.1 29,32.9 27.89,34.01 v27.89,35.66 v27.9,35.67
  Bottom 0.305: KIT1.D+ v27.9,35.67 29.11,36.88 CANCEL.1
B3  (via drill 0.35)
  Top 0.305: R12.1 28.4,19.3 v27.7,20
  Bottom 0.305: KIT1.P$22 27.7,14.94 v27.7,20 27.7,20.68 OK.1
B4  (via drill 0.35)
  Top 0.305: R13.1 32.3,6.74 v32.3,6.8
  Bottom 0.305: KIT1.P$21 28.92,10.27 BX.1 32.3,6.89 v32.3,6.8
BLE_CS  (via drill 0.35)
  Top 0.254: v13.7,6.8 13.7,7.92 AT-328P.12
  Bottom 0.254: v13.7,6.8 13.7,5.8 15.25,4.25 BLE/ICSP.6
BLE_IRQ  (via drill 0.35)
  Top 0.254: AT-328P.11 12.64,7.99 v12.64,7.61
  Bottom 0.254: v12.64,7.61 12.64,2.57 BLE/ICSP.5
GND
  pour Top: 0,0 37.77,0.2 37.77,61.8 0,61.59
  pour Bottom: 0,0 37.87,0.1 37.87,61.7 0,61.59
I2CADDR_3V  (via drill 0.35)
  Top 0.203: 22,43.56 U2.17
  Top 0.305: v24.1,34.6 24.1,37.9 22.8,39.2 R6.1 22.8,42.52 22.8,42.53 22.8,43.2 22.44,43.56 22,43.56
  Bottom 0.305: KIT1.P$30 v24.1,34.6 24.1,46.3 22.05,48.35 22.05,52.23 19.4,54.88 JP1.2
IN/TRIG  (via drill 0.4 pad 0.6)
  Top 0.254: MOTOR.P$4 9.84,49.3
  Top 0.305: 9.84,49.3 9.84,48.2 10.03,48.01 v10.03,45.09
  Bottom 0.254: 13.97,40.13 13.97,35.69
  Bottom 0.305: v10.03,45.09 13.97,41.15 13.97,35.69 13.97,33.73 15.45,32.25 16.25,32.25 21.55,26.95 21.55,26.15 23.85,23.85 23.85,21.15 24.57,20.43 KIT1.P$25
INT1  (via drill 0.35)
  Top 0.305: ALT_SENSOR.6 18.55,28.15 19.5,27.2 19.5,23.76 v23.73,19.53
  Bottom 0.305: KIT1.P$24 v23.73,19.53
INT2  (via drill 0.35)
  Top 0.305: ALT_SENSOR.5 18,26.9 18.9,26 18.9,21.84 v23.73,17.01
  Bottom 0.305: KIT1.P$23 v23.73,17.01
INT_3V  (via drill 0.35)
  Top 0.305: v21.2,34.96 21.2,38.6 20.65,39.15 U2.14
  Bottom 0.305: KIT1.P$29 v21.2,34.96
N$1
  Top 0.305: R14.2 29.92,2.71 ON/OFF.A
N$2
  Top 0.305: ALT_SENSOR.2 9.4,29.4 9.06,29.05 9.06,27.99 C9.1
N$3
  Top 0.254: C6.2 18.15,40.56 U2.9
N$6
  Top 0.254: 7.6,50.6 MOTOR.P$1
  Top 0.305: C3.1 7.11,50.6 7.6,50.6
NRESET_3V
  Top 0.254: U2.11 19.15,41.5 19.74,40.92 D1.A 19.72,38.73 15.69,38.73 R3.1
OUT+
  Top 0.254: MOTOR.P$7 9.84,56.3
  Top 0.305: +.1 10.76,57.37 9.84,56.45 9.84,56.3
OUT-
  Top 0.254: MOTOR.P$9 8.84,56.3
  Top 0.305: 8.84,56.3 8.84,56.44 7.91,57.37 -.1
RST_5V  (via drill 0.35)
  Top 0.305: v19.74,32.3 D1.C
  Bottom 0.305: v19.74,32.3 19.74,29.41 22.01,27.14 22.01,26.53 KIT1.P$26
SCL(2)_5V  (via drill 0.35)
  Top 0.305: AT-328P.28 21.94,15.03 v21.94,16.85 21.94,18.06 19.2,20.8 R9.1 | 21.94,25.3 21.94,25.41 21.94,25.44 v23.73,27.1 21.94,25.31 v21.94,23.43 21.94,25.3
  Bottom 0.305: KIT1.P$27 23.78,27.1 v23.73,27.1 | v21.94,16.85 v21.94,23.43
SCL_3V  (via drill 0.4, 0.4 pad 0.6)
  Top 0.254: v23.11,44.2 22.75,44.56 U2.19 | R1.1 15.1,33.18 v15.47,33.55 15.47,30.89 ALT_SENSOR.8
  Top 0.305: Q2.2 11.77,33.16 R1.1
  Bottom 0.254: v15.47,33.55 21.92,40.01 21.92,41.1 23.11,42.29 v23.11,44.2
SCL_5V  (via drill 0.35, 0.4, 0.4 pad 0.6)
  Top 0.254: MOTOR.P$2 8.84,49.4
  Top 0.305: 9.02,35.73 Q2.3 9.05,35.78 6.18,38.65 R5.1 | 8.84,49.4 8.84,49.28 8.26,48.69 v8.26,47.75 | v7.52,43.18 7.52,41.81 5.76,40.05 R5.1 | v4.02,36.98 4.09,36.98 R5.1
  Bottom 0.305: v8.26,47.75 7.52,47.01 v7.52,43.18 | KIT1.P$10 v4.02,36.98
SDA(2)_5V  (via drill 0.35)
  Top 0.305: AT-328P.27 22.8,14.75 v22.8,15.6 | R8.1 14.8,22.1 v15.4,22.7 | v20.5,26 23.4,28.9 v23.73,28.9
  Bottom 0.305: KIT1.P$28 24.72,28.9 v23.73,28.9 | v22.8,15.6 22.8,23.8 v20.5,26 17.2,22.7 v15.4,22.7
SDA_3V  (via drill 0.4, 0.4 pad 0.6)
  Top 0.254: v22.35,45.97 21.46,45.97 21.15,45.66 U2.20 | Q1.2 11.76,37.7 R2.1 12.18,37.66 12.18,36.72 12.5,36.4 14.27,36.4 v15.81,34.86 17.51,33.16 17.51,30.07 16.83,29.4 ALT_SENSOR.7
  Bottom 0.254: v15.81,34.86 15.86,34.86 21.4,40.4 21.4,43.05 22.35,44 v22.35,45.97
SDA_5V  (via drill 0.35)
  Top 0.254: MOTOR.P$3 9.34,49.3
  Top 0.305: 9.1,42.59 Q1.3 9.1,42.89 7.09,44.9 | 7.09,44.9 R4.1 v5.95,41.45 | 9.34,49.3 9.34,47.15 7.09,44.9
  Bottom 0.305: KIT1.P$9 v5.95,41.45
XIN_A
  Top 0.254: U3.4 18.03,48.32 | U2.27 17.65,46.99 18.03,47.37 18.03,48.04 U3.4 | C7.1 U3.4
XOUT_A
  Top 0.254: 21.3,47.21 21.3,48.27 U3.1 23.62,48.32
  Top 0.305: U2.26 18.15,46.47 18.89,47.21 21.3,47.21 | 23.62,48.32 C8.1
XTAL_A
  Top 0.305: AT-328P.7 12.68,13.7 11.2,13.7 10.2,12.7 10.2,11.6 9.4,10.8 XC.3
XTAL_B
  Top 0.305: AT-328P.8 10.3,10.02 10.3,9.1 9.61,8.4 XC.1

### Text on the board
bPlace: v0.1 | @arturorosete2